# EAGLE design audio sw - daughter - rev 0.1 (EAGLE 6.5.0)
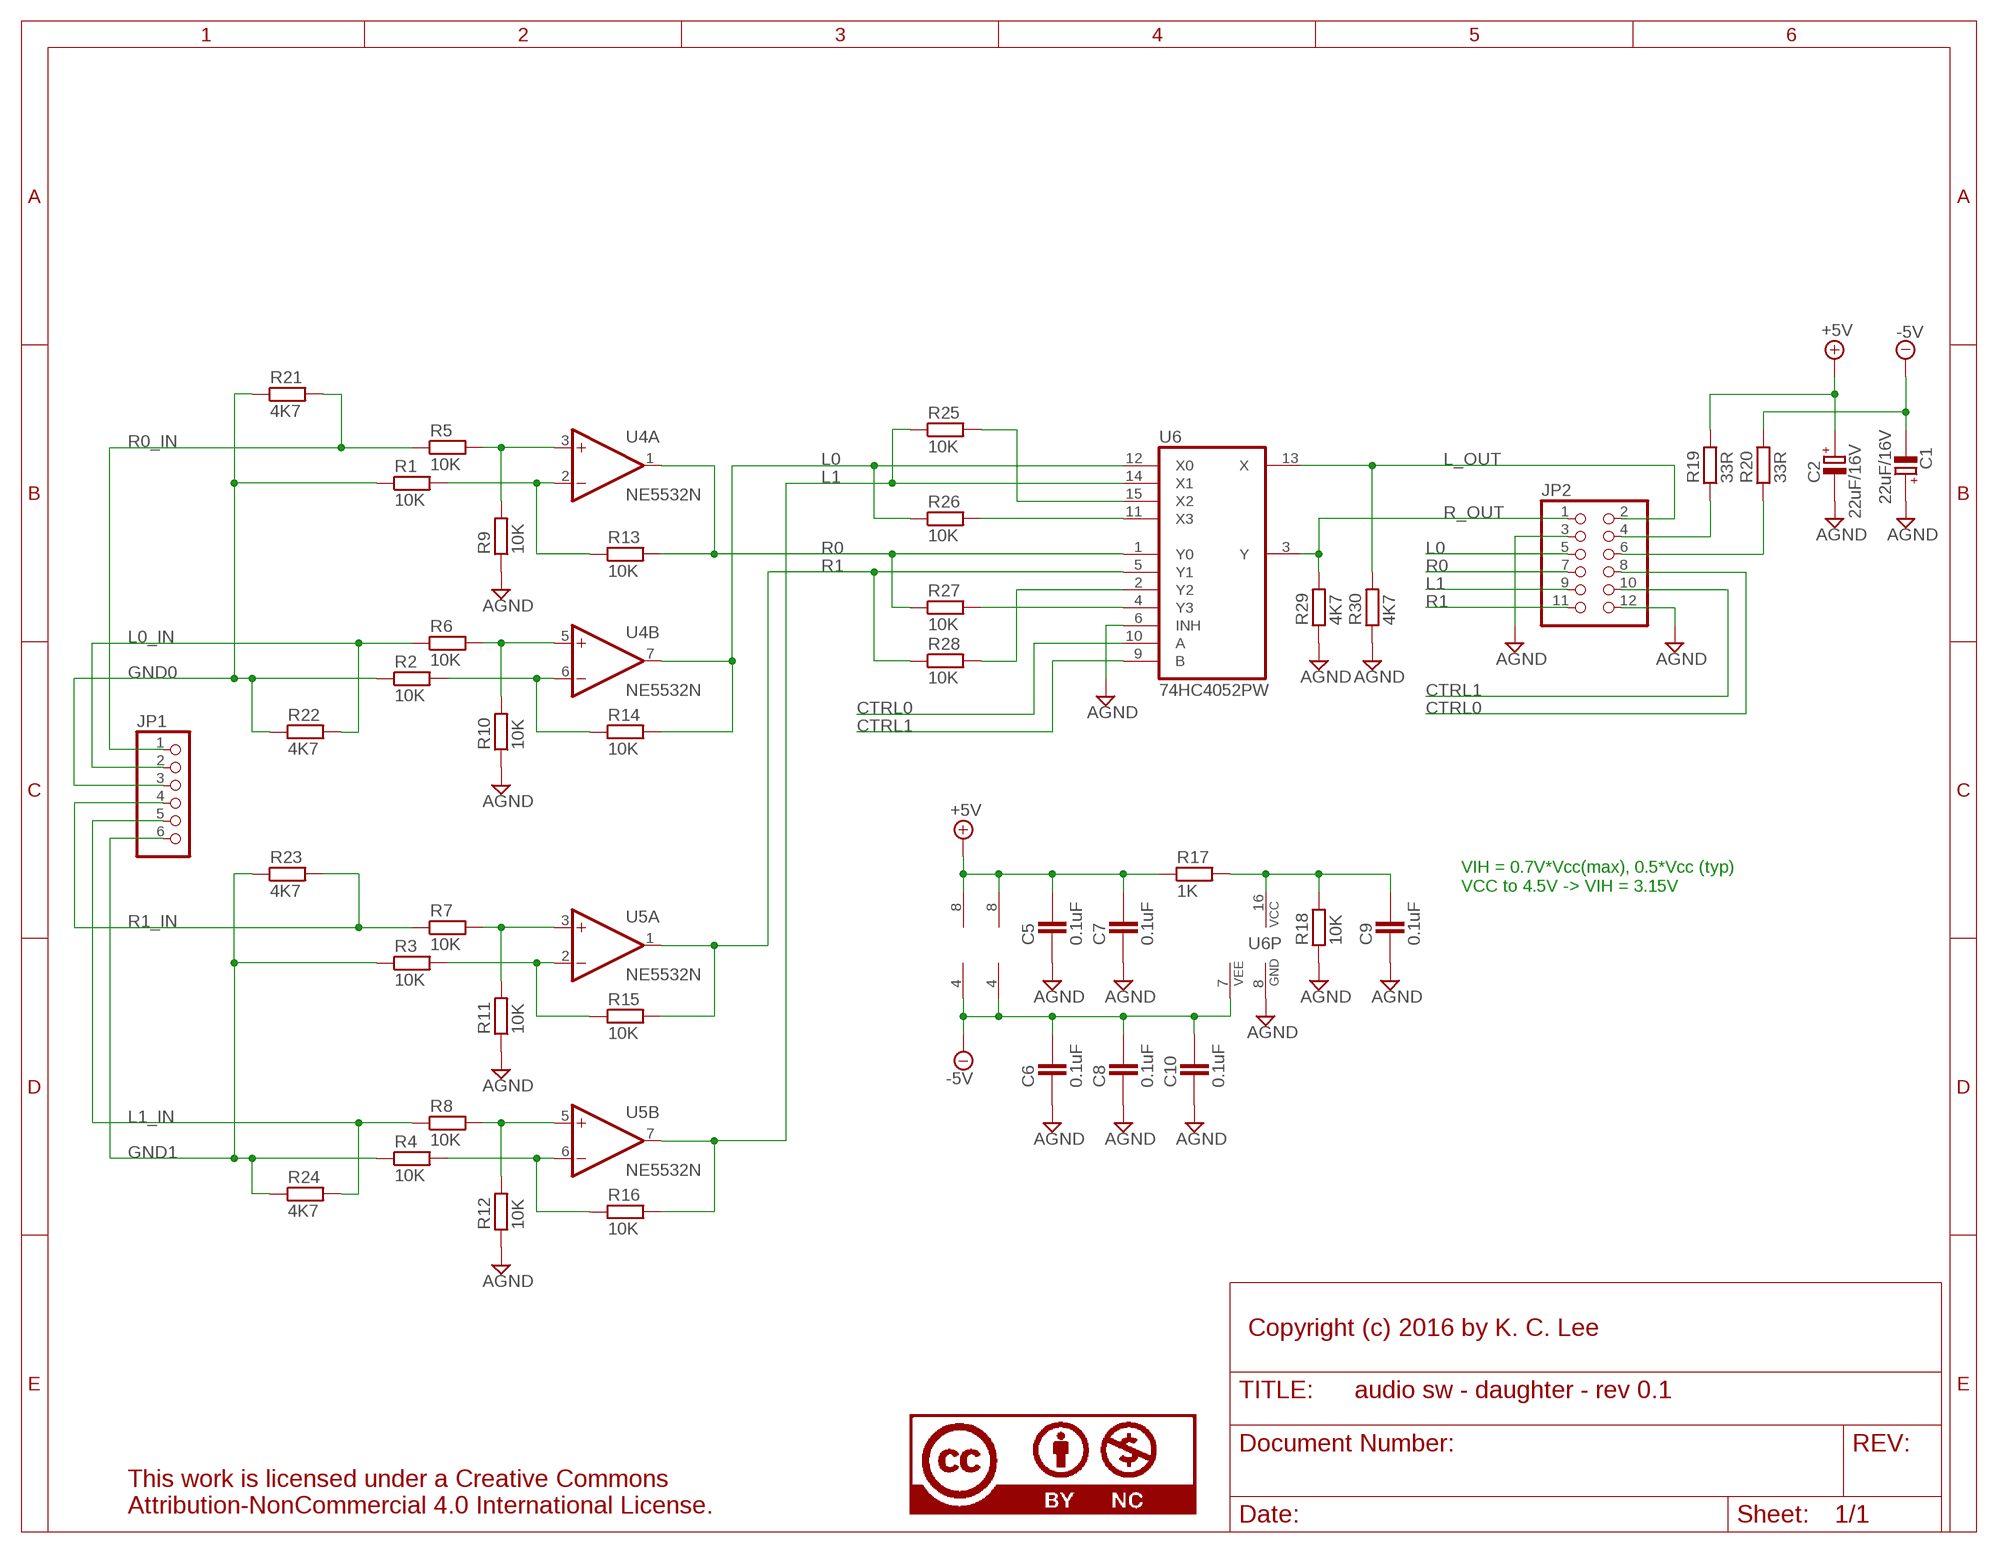
[diagram p0: schematic, sheet 1]

## Parts
C1  22uF/16V  POLARISED_C_CASE  [CAPMP6032X280N]
C2  22uF/16V  POLARISED_C_CASE  [CAPMP6032X280N]
C5  0.1uF  CAPACITOR_0603  [CAPC1608X92N]
C6  0.1uF  CAPACITOR_0603  [CAPC1608X92N]
C7  0.1uF  CAPACITOR_0603  [CAPC1608X92N]
C8  0.1uF  CAPACITOR_0603  [CAPC1608X92N]
C9  0.1uF  CAPACITOR_0603  [CAPC1608X92N]
C10  0.1uF  CAPACITOR_0603  [CAPC1608X92N]
JP1  PINHD-1X6  [1X06]
JP2  PINHD-2X6_2.54  [2X06]
LICENSE1  CC-BY-NC75%  [CC-BY-NC-75]
R1  10K  RESISTOR_0603  [RESC1608X55N]
R2  10K  RESISTOR_0603  [RESC1608X55N]
R3  10K  RESISTOR_0603  [RESC1608X55N]
R4  10K  RESISTOR_0603  [RESC1608X55N]
R5  10K  RESISTOR_0603  [RESC1608X55N]
R6  10K  RESISTOR_0603  [RESC1608X55N]
R7  10K  RESISTOR_0603  [RESC1608X55N]
R8  10K  RESISTOR_0603  [RESC1608X55N]
R9  10K  RESISTOR_0603  [RESC1608X55N]
R10  10K  RESISTOR_0603  [RESC1608X55N]
R11  10K  RESISTOR_0603  [RESC1608X55N]
R12  10K  RESISTOR_0603  [RESC1608X55N]
R13  10K  RESISTOR_0603  [RESC1608X55N]
R14  10K  RESISTOR_0603  [RESC1608X55N]
R15  10K  RESISTOR_0603  [RESC1608X55N]
R16  10K  RESISTOR_0603  [RESC1608X55N]
R17  1K  RESISTOR_0603  [RESC1608X55N]
R18  10K  RESISTOR_0603  [RESC1608X55N]
R19  33R  RESISTOR_0805  [RESC2012X70N]
R20  33R  RESISTOR_0805  [RESC2012X70N]
R21  4K7  RESISTOR_0603  [RESC1608X55N]
R22  4K7  RESISTOR_0603  [RESC1608X55N]
R23  4K7  RESISTOR_0603  [RESC1608X55N]
R24  4K7  RESISTOR_0603  [RESC1608X55N]
R25  10K  RESISTOR_0603  [RESC1608X55N]
R26  10K  RESISTOR_0603  [RESC1608X55N]
R27  10K  RESISTOR_0603  [RESC1608X55N]
R28  10K  RESISTOR_0603  [RESC1608X55N]
R29  4K7  RESISTOR_0603  [RESC1608X55N]
R30  4K7  RESISTOR_0603  [RESC1608X55N]
U4  NE5532N  LM358D  [SO08]
U5  NE5532N  LM358D  [SO08]
U6  74HC4052PW  4052PW  [TSSOP16]

## Nets
+5V: C2.+ C5.2 C7.2 R17.1 R19.2 U4.8(P:V+) U5.8(P:V+)
-5V: C1.- C6.2 C8.2 C10.2 R20.2 U4.4(P:V-) U5.4(P:V-) U6.7(VEE)
AGND: C1.+ C2.- C5.1 C6.1 C7.1 C8.1 C9.1 C10.1 JP2.3 JP2.12 R9.1 R10.1 R11.1 R12.1 R18.1 R29.1 R30.1 U6.6(INH) U6.8(GND)
CTRL0: JP2.8 U6.10(A)
CTRL1: JP2.10 U6.9(B)
GND0: JP1.3 R1.1 R2.1 R21.1 R22.1
GND1: JP1.6 R3.1 R4.1 R23.1 R24.1
L0: JP2.5 R14.2 R26.1 U4.7(B:OUT) U6.12(X0)
L0_IN: JP1.2 R6.1 R22.2
L1: JP2.9 R16.2 R25.1 U5.7(B:OUT) U6.14(X1)
L1_IN: JP1.5 R8.1 R24.2
L_OUT: JP2.2 R30.2 U6.13(X)
N$1: R5.2 R9.2 U4.3(A:+IN)
N$2: R1.2 R13.1 U4.2(A:-IN)
N$3: C9.2 R17.2 R18.2 U6.16(VCC)
N$4: R26.2 U6.11(X3)
N$5: R25.2 U6.15(X2)
N$6: R6.2 R10.2 U4.5(B:+IN)
N$7: R2.2 R14.1 U4.6(B:-IN)
N$8: JP2.4 R19.1
N$9: R27.2 U6.4(Y3)
N$10: JP2.6 R20.1
N$11: R7.2 R11.2 U5.3(A:+IN)
N$12: R3.2 R15.1 U5.2(A:-IN)
N$13: R28.2 U6.2(Y2)
N$16: R8.2 R12.2 U5.5(B:+IN)
N$17: R4.2 R16.1 U5.6(B:-IN)
R0: JP2.7 R13.2 R27.1 U4.1(A:OUT) U6.1(Y0)
R0_IN: JP1.1 R5.1 R21.2
R1: JP2.11 R15.2 R28.1 U5.1(A:OUT) U6.5(Y1)
R1_IN: JP1.4 R7.1 R23.2
R_OUT: JP2.1 R29.2 U6.3(Y)

## Notes on the sheet
- VIH = 0.7V*Vcc(max), 0.5*Vcc (typ)
  VCC to 4.5V -> VIH = 3.15V
- Copyright (c) 2016 by K. C. Lee

## Library data of the parts
C1 C2 = ipc-7351-capacitor:POLARISED_; PARTNO: *
C5-C10 = ipc-7351-capacitor:CAPACITOR_; PARTNO: *
JP1 = Misc Conn:PINHD-1X6: PIN HEADER; PARTNO: *
JP2 = pinhead-1:PINHD-2X6: PIN HEADER; PARTNO: *
LICENSE1 = Misc logo:CC-BY-NC; PARTNO: *
R1-R30 = ipc-7351-resistor:RESISTOR_; PARTNO: *
U4 U5 = linear:LM358: OP AMP also LM158; LM258; LM2904 Source: http://cache.national.com/ds/LM/LM158.pdf; PARTNO: *
U6 = Misc Logic:4052: Dual 4-channel ANALOG MULTIPLEXER; PARTNO: *

## Board
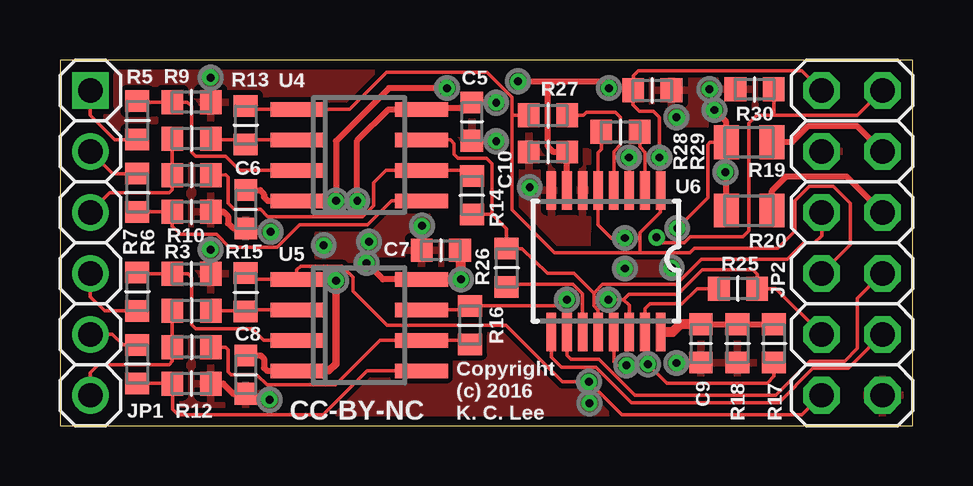
[diagram p1: board, top side]
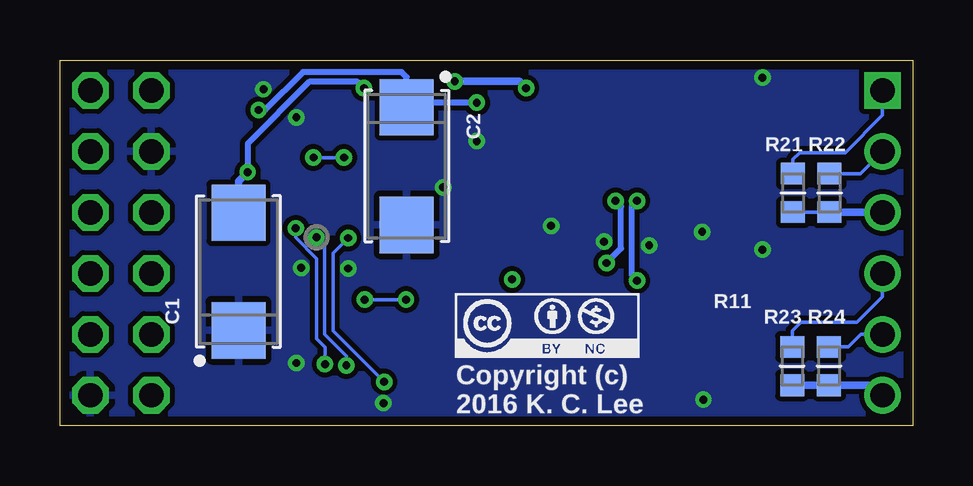
[diagram p2: board, bottom side, seen from below]

Size 35.56 x 15.24 mm. Coordinates in mm from the lower left corner, seen from the top.
Outline: 0,0 35.56,0 35.56,15.24 0,15.24 0,0
Copper layers (1*16): Top 0.0356mm / dielectric 1.5011mm / Bottom 0.0356mm
Design rules "oshpark-2layer": minimum track width 6mil, minimum drill 13mil, track to track 6mil, track to pad 6mil, pad to pad 6mil, via to via 6mil, smd to smd 6mil, copper to edge 15mil, drill to drill 6mil, minimum pad ring 7mil, minimum via ring 7mil, stop-mask expansion 4mil, vias tented up to drill 0mil, thermal gap 10mil
tRestrict: 24 lines

### Footprints (pad centres in the part's own frame; a part is rotated, then mirrored left to right if it is on the bottom)
CAPMP6032X280N = smd 2.35 x 2.25: + -2.45,0; - 2.45,0
CAPC1608X92N = smd 0.9 x 0.95: 1 -0.8,0; 2 0.8,0
1X06 = drill 1.016 square: 1 -6.35,0 | drill 1.016: 2 -3.81,0; 3 -1.27,0; 4 1.27,0; 5 3.81,0; 6 6.35,0
2X06 = drill 1.016 octagon: 1 -6.35,-1.27; 2 -6.35,1.27; 3 -3.81,-1.27; 4 -3.81,1.27; 5 -1.27,-1.27; 6 -1.27,1.27; 7 1.27,-1.27; 8 1.27,1.27; 9 3.81,-1.27; 10 3.81,1.27; 11 6.35,-1.27; 12 6.35,1.27
RESC1608X55N = smd 0.9 x 1: 1 -0.8,0; 2 0.8,0
RESC2012X70N = smd 1.05 x 1.4: 1 -0.95,0; 2 0.95,0
SO08 = smd 0.6 x 2.2: 1 -1.905,-2.6; 2 -0.635,-2.6; 3 0.635,-2.6; 4 1.905,-2.6; 5 1.905,2.6; 6 0.635,2.6; 7 -0.635,2.6; 8 -1.905,2.6
TSSOP16 = smd 0.4 x 1.6: 1 -2.275,-2.85; 2 -1.625,-2.85; 3 -0.975,-2.85; 4 -0.325,-2.85; 5 0.325,-2.85; 6 0.975,-2.85; 7 1.625,-2.85; 8 2.275,-2.85; 9 2.275,3.05; 10 1.625,3.05; 11 0.975,3.05; 12 0.325,3.05; 13 -0.325,3.05; 14 -0.975,3.05; 15 -1.625,3.05; 16 -2.275,3.05

### Placement (x,y rotation side)
C1  28.12,6.43 90 bottom
C2  21.11,10.82 270 bottom
C5  17.17,12.67 90 top
C6  7.75,9.02 90 top
C7  15.88,7.32 0 top
C8  7.75,2.13 90 top
C9  26.72,3.43 90 top
C10  20.35,11.4 0 top
JP1  1.27,7.62 270 top
JP2  33.02,7.62 270 top
LICENSE1  19.08,2.84 0 bottom
R1  5.49,11.96 0 top
R2  5.49,10.44 0 top
R3  5.49,4.8 0 top
R4  5.49,3.28 0 top
R5  3.23,12.73 90 top
R6  3.23,9.7 270 top
R7  3.23,5.59 90 top
R8  3.23,2.57 270 top
R9  5.49,13.49 180 top
R10  5.49,8.92 180 top
R11  5.49,6.32 180 top
R12  5.49,1.75 180 top
R13  7.75,12.52 90 top
R14  17.17,9.6 270 top
R15  7.75,5.56 90 top
R16  17.09,4.19 90 top
R17  29.77,3.43 90 top
R18  28.24,3.43 90 top
R19  28.73,11.81 180 top
R20  28.73,8.97 180 top
R21  5,9.7 90 bottom
R22  3.48,9.7 90 bottom
R23  5.03,2.49 90 bottom
R24  3.51,2.49 90 bottom
R25  28.27,5.71 180 top
R26  18.62,6.58 270 top
R27  20.35,12.93 0 top
R28  23.37,12.24 0 top
R29  24.69,13.97 180 top
R30  28.96,14.02 0 top
U4  12.47,11.28 270 top
U5  12.47,4.19 270 top
U6  22.76,6.96 180 top

### Tracks (layer width: path | path; a pad name or v marks a point on that pad's centre or on a via)
+5V  (via drill 0.33)
  Top 0.152: R17.1 29.77,2.06 29.49,1.78 25.3,1.78 v24.51,2.56 | v25.73,8.23 27,9.5 27,11.71 27.1,11.81 R19.2
  Top 0.254: U5.8 13.46,6.1 v12.78,6.78 | v12.39,9.37 12.39,11.89 13.69,13.18 U4.8 15.93,13.18 16,13.26 16.95,13.26 C5.2 17.18,13.46 v18.19,13.46 | v27.28,13.16 27.48,12.95 27.78,12.66 R19.2
  Top 0.305: v16.71,6.1 U5.8
  Top 0.406: v16.71,6.1 16.71,7.28 C7.2
  Bottom 0.152: v24.51,2.56 24.51,3.28 24.87,3.63 24.87,6.96 25.73,7.85 v25.73,8.23
  Bottom 0.254: v12.78,6.78 12.17,7.39 12.17,9.14 v12.39,9.37 | v27.28,13.16 27,13.16 25.43,14.73 21.31,14.73 21.11,14.53 C2.+ 20.92,13.46 v18.19,13.46
-5V  (via drill 0.33)
  Top 0.254: U6.7 21.13,11.37 C10.2 20.57,11.4 20.34,11.63 20.34,14.33 20.32,14.35 | v16.13,14.07 13.72,14.07 11.51,11.86 v11.51,9.37 | C8.2 8.37,2.93 8.51,2.79 8.51,2.41 8.64,2.29 U5.4 | C6.2 8.34,9.82 8.51,9.65 8.51,9.53 8.66,9.37 U4.4 | v27.74,10.57 27.78,10.53 R20.2 | v19.1,14.35 20.32,14.35 | 20.32,14.35 22.61,14.35 v22.89,14.07
  Top 0.305: 9.84,9.45 U4.4 v11.51,9.37 | U5.4 11.2,2.29 11.51,2.59 v11.51,6.04
  Bottom 0.254: v11.51,6.04 11.71,6.25 11.71,9.17 v11.51,9.37 | v22.89,14.07 23.14,14.33 25.17,14.33 27.74,11.76 v27.74,10.57
  Bottom 0.305: v19.1,14.35 16.41,14.35 v16.13,14.07 | C1.- 28.12,10.19 v27.74,10.57
AGND  (via drill 0.33)
  Top 0.254: C8.1 7.23,1.33 6.81,1.75 R12.1 | R10.1 6.83,8.91 7.01,8.74 7.01,8.43 7.19,8.26 7.71,8.26 C6.1
  other vias: 25.7,12.85 19.58,9.93 23.55,6.55 25.7,2.62 25.5,6.58 8.74,1.09 8.79,8.08 6.27,7.34 6.27,14.5 11,7.52 15.09,8.33 18.19,11.86 12.88,7.67 27.08,14.02 22.07,0.94
  pour Bottom (isolate 0.203, rank 2): 0,15.37 0,0 35.56,0 35.56,15.37
  pour Top (isolate 0.203, rank 2): 35.56,15.37 35.56,0 0,0 0,15.37
CTRL0
  Top 0.152: JP2.8 33.25,5.31 33.25,3.23 32.72,2.69 31.27,2.69 29.84,1.27 23.98,1.27 22.48,2.77 21.31,2.77 21.13,2.95 U6.10
CTRL1
  Top 0.152: JP2.10 32.87,2.39 31.39,2.39 29.97,0.96 23.82,0.96 22.35,2.44 20.9,2.44 20.48,2.86 U6.9
GND0
  Top 0.152: JP1.3 2.08,9.7 4.55,9.7 4.69,9.84 R2.1 R1.1
  Bottom 0.152: R21.1 R22.1
  Bottom 0.305: JP1.3 3.31,8.89 R22.1
GND1
  Top 0.152: R3.1 R4.1 4.69,2.68 4.55,2.54 1.6,2.54 1.27,2.21 JP1.6
  Bottom 0.305: JP1.6 1.69,1.69 R24.1 R23.1
L0
  Top 0.152: 18.01,8.81 18.01,10.92 17.78,11.15 16.59,11.15 16.43,11.3 16.43,11.76 16.28,11.91 U4.7 | 18.01,8.81 17,8.81 R14.2 | 18.01,8.81 18.62,8.2 R26.1 19.27,7.38 20.32,6.35 21.42,6.35 22.25,5.52 | U6.12 22.43,4.82 22.25,5 22.25,5.52 | 22.25,5.52 22.62,5.89 25.7,5.89 26.75,6.93 30.33,6.93 31.01,7.62 31.45,7.62 31.75,7.92 JP2.5
L0_IN
  Top 0.152: R6.1 2.2,10.5 JP1.2
  Bottom 0.152: R22.2 2.2,10.5 JP1.2
L1  (via drill 0.33)
  Top 0.152: U5.7 16.7,4.83 R16.2 20.87,4.99 v21.13,5.26 | v22.86,5.26 23.5,5.26 | 23.5,5.26 23.73,5.02 U6.14 | 23.5,5.26 23.72,5.49 25.76,5.49 26.77,6.5 28.88,6.5 29.07,6.31 R25.1 29.84,5.71 JP2.9
  Bottom 0.152: v22.86,5.26 v21.13,5.26
L1_IN
  Top 0.152: R8.1 2.63,3.37 2.18,3.81 JP1.5
  Bottom 0.152: JP1.5 2.18,3.81 2.69,3.3 3.37,3.3 R24.2
L_OUT  (via drill 0.33)
  Top 0.152: JP2.2 33.25,12.93 29.74,12.93 | 29.74,12.93 29.06,12.93 28.73,12.6 28.73,8.13 28.47,7.87 26.29,7.87 26.04,7.62 25.09,7.62 v24.87,7.85 | U6.13 23.08,2.67 23.24,2.52 v23.62,2.52 | R30.2 29.76,12.94 29.74,12.93
  Bottom 0.152: v23.62,2.52 23.62,2.9 24.54,3.81 24.54,7.52 v24.87,7.85
N$1
  Top 0.152: R5.2 3.26,13.49 R9.2 5.31,13.49 5.49,13.31 5.49,11.4 5.66,11.23 6.91,11.23 7.49,10.64 U4.3
N$2
  Top 0.152: 6.31,11.94 R1.2 6.32,11.93 7.67,11.93 R13.1 7.84,11.91 U4.2
N$3
  Top 0.254: C9.2 R18.2 R17.2
  Top 0.406: U6.16 25.55,3.91 25.87,4.23 C9.2
N$4
  Top 0.152: U6.11 21.78,5.5 21.39,5.89 18.55,5.89 R26.2
N$5
  Top 0.152: U6.15 24.38,4.88 24.59,5.08 25.93,5.08 26.57,5.71 R25.2
N$6
  Top 0.152: R6.2 3.44,8.91 R10.2 4.69,8.32 5.03,7.98 6.53,7.98 7.06,7.44 9.04,7.44 9.98,8.38 12.83,8.38 13.82,9.37 U4.5
N$7
  Top 0.152: R2.2 6.91,10.46 7.01,10.36 7.01,9.27 7.26,9.02 8.36,9.02 8.66,8.71 12.62,8.71 13.08,9.17 13.08,10.13 13.59,10.64 U4.6 16.98,10.64 R14.1
N$8
  Top 0.254: JP2.4 33.22,12.5 31.19,12.5 30.5,11.81 R19.1
N$9
  Top 0.152: U6.4 23.08,11.43 23.37,11.71 23.37,12.85 23.16,13.06 21.95,13.06 21.82,12.93 R27.2
N$10
  Top 0.254: JP2.6 32.79,10.39 30.28,10.39 29.68,9.79 R20.1
N$11
  Top 0.152: R7.2 3.31,6.33 R11.2 5.33,6.33 5.49,6.17 5.49,4.22 5.66,4.04 8,4.04 8.48,3.56 U5.3
N$12
  Top 0.152: R3.2 7.62,4.8 7.73,4.81 R15.1 7.79,4.83 U5.2
N$13
  Top 0.152: R28.2 24.17,11.62 24.38,11.4 U6.2
N$16
  Top 0.152: R8.2 4.7,1.76 | 4.7,1.76 R12.2 | 4.7,1.76 4.7,0.69 4.93,0.46 10.97,0.46 12.8,2.29 U5.5
N$17
  Top 0.152: R16.1 16.95,3.49 16.84,3.56 U5.6 13.34,3.56 11.48,1.7 8.64,1.7 8.2,2.13 7.14,2.13 7.01,2.26 7.01,3.17 6.91,3.28 R4.2
R0
  Top 0.152: JP2.7 32.94,7.54 32.94,9.27 32.23,9.98 31.24,9.98 30.63,9.37 30.63,8.1 29.92,7.39 26.44,7.39 26.26,7.21 24.18,7.21 | 24.18,7.21 20.62,7.21 18.85,8.99 18.85,12.93 | R13.2 7.96,13.18 U4.1 12.06,13.18 13.61,14.73 17.8,14.73 18.85,13.69 18.85,12.93 | 24.18,7.21 24.17,7.22 24.17,8.04 25.03,8.9 U6.1 | R27.1 18.85,12.93
R0_IN
  Top 0.152: R5.1 2.27,11.93 1.27,12.93 JP1.1
  Bottom 0.152: R21.2 5,11.1 4.72,11.38 2.82,11.38 1.27,12.93 JP1.1
R1  (via drill 0.33)
  Top 0.152: v23.55,7.82 22.99,7.82 22.43,8.38 U6.5 22.43,11.38 22.57,11.52 R28.1 | JP2.11 30.94,0.46 23.42,0.46 v22.05,1.83 20.95,1.83 18.59,4.19 13.64,4.19 12.22,5.61 12.22,6.2 11.76,6.66 10.03,6.66 9.87,6.49 U5.1 8.06,6.1 R15.2
  Bottom 0.152: v23.55,7.82 24.18,7.19 24.18,3.96 v22.05,1.83
R1_IN
  Top 0.152: R7.1 1.87,4.79 1.27,5.38 JP1.4
  Bottom 0.152: R23.2 5.03,3.96 4.67,4.32 2.34,4.32 1.27,5.38 JP1.4
R_OUT  (via drill 0.33)
  Top 0.152: JP2.1 30.94,14.78 24.11,14.78 23.9,14.58 R29.2 23.89,13.37 24.16,13.11 24.74,13.11 24.99,12.85 v24.99,11.18 | U6.3 23.73,11.17 v23.72,11.18
  Bottom 0.152: v23.72,11.18 v24.99,11.18

### Text on the board
tPlace: CC-BY-NC | Copyright / (c) 2016 / K. C. Lee
bPlace: Copyright (c) / 2016 K. C. Lee